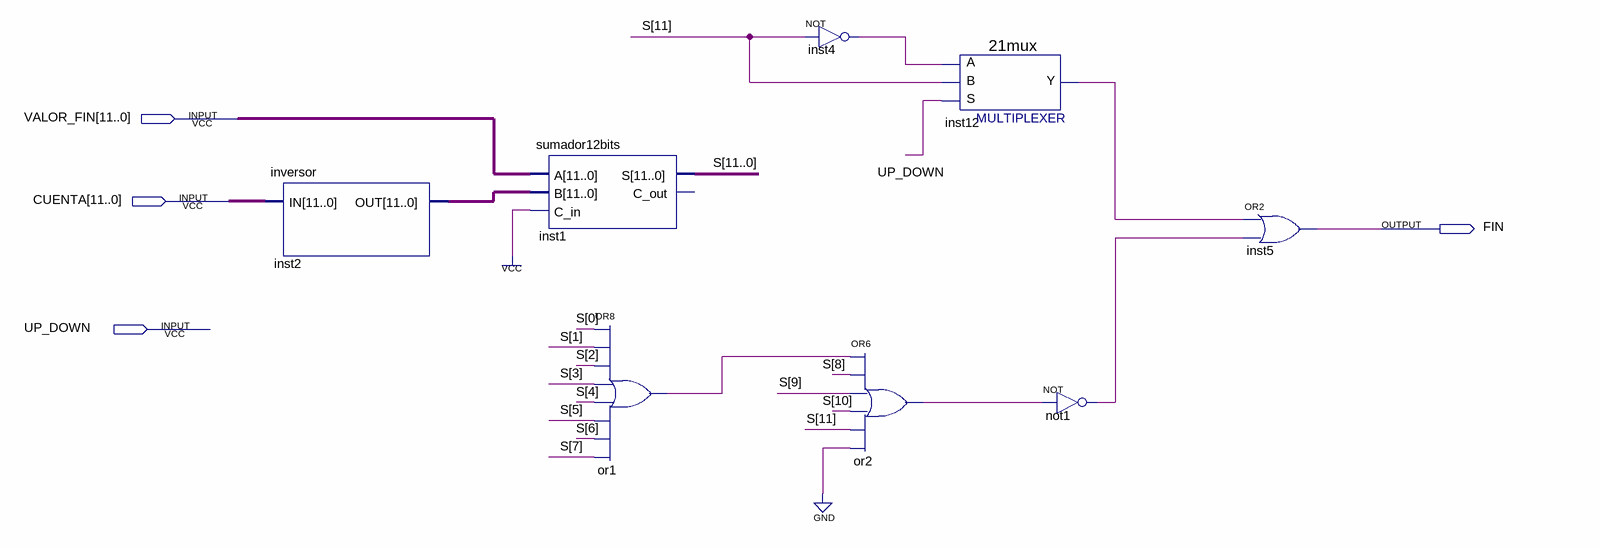
[diagram p0: schematic sheet]
// Quartus schematic Comparador.bdf as structural Verilog: 8 symbols, 4 pins
module Comparador (
  input  [11:0] VALOR_FIN,
  input  [11:0] CUENTA,
  input  UP_DOWN,
  output FIN
);

  wire inst4_out, inst12_y, not1_out, or1_out, or2_out;
  wire [11:0] inst2_out, S;

  inversor inst2 (.IN(CUENTA), .OUT(inst2_out));
  sumador12bits inst1 (.A(VALOR_FIN), .B(inst2_out), .C_in(1'b1), .S(S));  // open: C_out
  or or1 (or1_out, S[0], S[1], S[2], S[3], S[4], S[5], S[6], S[7]);
  not inst4 (inst4_out, S[11]);
  or or2 (or2_out, or1_out, S[8], S[9], S[10], S[11], 1'b0);
  \21mux  inst12 (.S(UP_DOWN), .B(S[11]), .A(inst4_out), .Y(inst12_y));
  not not1 (not1_out, or2_out);
  or inst5 (FIN, inst12_y, not1_out);
endmodule
